# EAGLE design board_v1 (EAGLE 7.5.0)

## Sheet 1 of 2
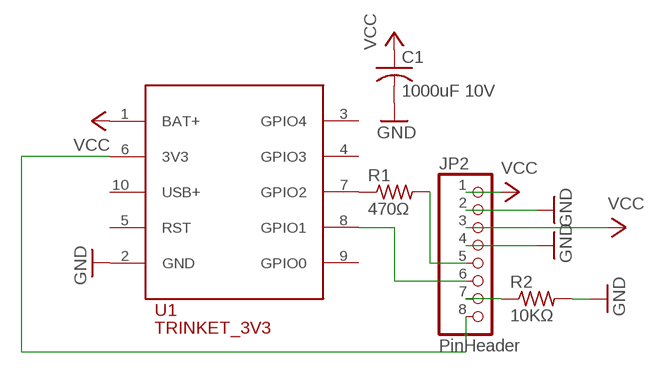
[diagram p0: schematic, sheet 1]

### Parts
C1  1000uF 10V  C-US050-025X075  [C050-025X075]
JP2  PinHeader  PINHD-1X8LOCK  [1X08-LOCK]
R1  470Ω  R-US_0204/7  [0204/7]
R2  10KΩ  R-US_0204/7  [0204/7]
U1  TRINKET_3V3  [TRINKET_3V3]

### Nets
GND: C1.2 JP2.2 JP2.4 R2.2 U1.2(GND)
N$1: R1.1 U1.7(GPIO2)
N$2: JP2.5 R1.2
N$3: JP2.8 U1.6(3V3)
N$4: JP2.6 U1.8(GPIO1)
N$5: JP2.7 R2.1
VCC: C1.1 JP2.1 JP2.3 U1.1(BAT+)
Unconnected: U1.3(GPIO4) U1.4(GPIO3) U1.5(RST) U1.9(GPIO0) U1.10(USB+)

## Sheet 2 of 2

## Library data of the parts
C1 = resistor:C-US: CAPACITOR, American symbol
JP2 = adafruit:PINHD-1X8: PIN HEADER
R1 R2 = resistor:R-US_: RESISTOR, American symbol
U1 = adafruit:TRINKET_3V3

## Net classes
0 default: width 0.305 mm, drill 0.508 mm

## Board
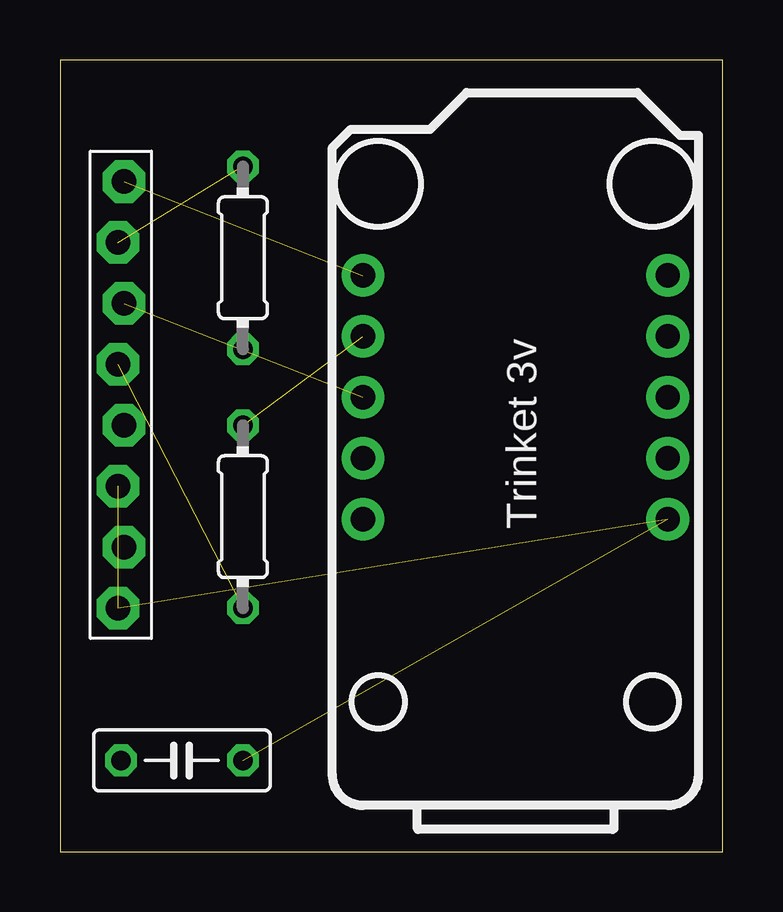
[diagram p1: board, top side]
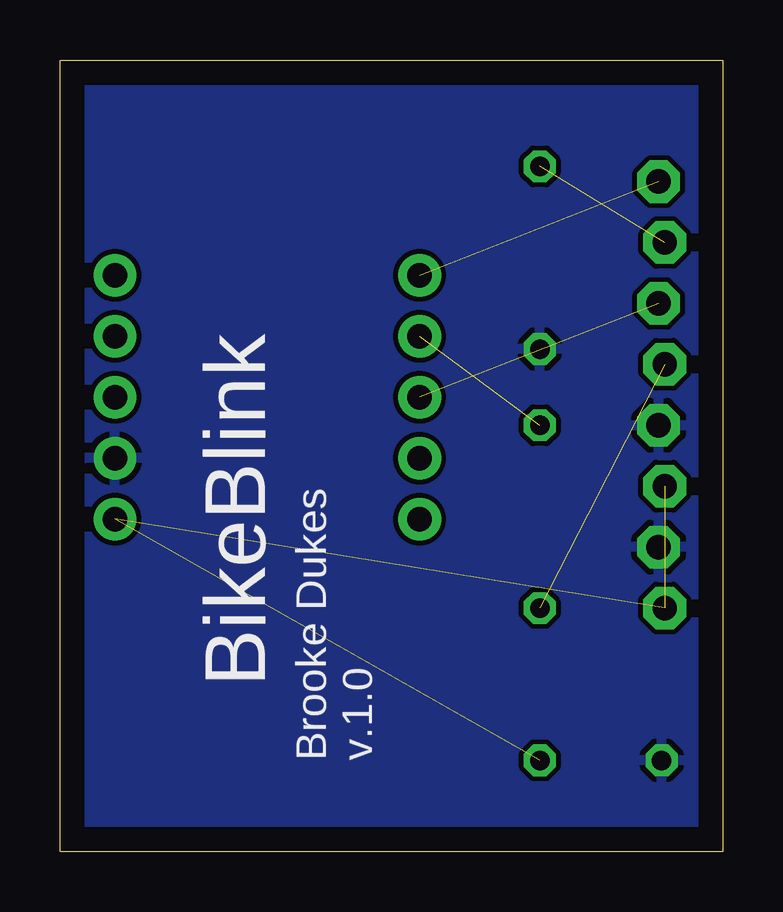
[diagram p2: board, bottom side, seen from below]

Size 27.61 x 33.01 mm. Coordinates in mm from the lower left corner, seen from the top.
Outline: 0,0 27.61,0 27.61,33.01 0,33.01 0,0
Copper layers (1*16): Top 0.035mm / dielectric 1.5mm / Bottom 0.035mm
Design rules "default": minimum track width 10mil, minimum drill 24mil, track to track 8mil, track to pad 8mil, pad to pad 8mil, via to via 8mil, smd to smd 8mil, copper to edge 40mil, drill to drill 8mil, minimum pad ring 10mil, minimum via ring 8mil, stop-mask expansion 4mil, vias tented up to drill 0mil, thermal gap 10mil

### Footprints (pad centres in the part's own frame; a part is rotated, then mirrored left to right if it is on the bottom)
C050-025X075 = drill 0.813 octagon: 1 -2.54,0; 2 2.54,0
1X08-LOCK = drill 1.016 pad 1.778 octagon: 1 -8.89,0.127; 2 -6.35,-0.127; 3 -3.81,0.127; 4 -1.27,-0.127; 5 1.27,0.127; 6 3.81,-0.127; 7 6.35,0.127; 8 8.89,-0.127
0204/7 = drill 0.813 octagon: 1 -3.81,0; 2 3.81,0
TRINKET_3V3 = drill 1.016 pad 1.778: 1 -6.274,2.007; 2 -6.274,-0.533; 3 -6.274,-3.073; 4 -6.274,-5.613; 5 -6.274,-8.153; 6 6.426,-8.153; 7 6.426,-5.613; 8 6.426,-3.073; 9 6.426,-0.533; 10 6.426,2.007

### Placement (x,y rotation side)
C1  5.08,3.81 180 top
JP2  2.54,19.05 90 top
R1  7.62,13.97 270 top
R2  7.62,24.77 270 top
U1  19.05,15.88 180 top

### Tracks (layer width: path | path; a pad name or v marks a point on that pad's centre or on a via)
GND
  pour Bottom: -1.27,34.29 -1.27,-1.27 28.57,-0.64 28.57,34.29
N$1  (1 unrouted)
N$2  (1 unrouted)
N$3  (1 unrouted)
N$4  (1 unrouted)
N$5  (1 unrouted)
VCC  (3 unrouted)

### Text on the board
_bsilk: BikeBlink | Brooke Dukes / v.1.0